# EAGLE schematic Full set (EAGLE 7.2.0)
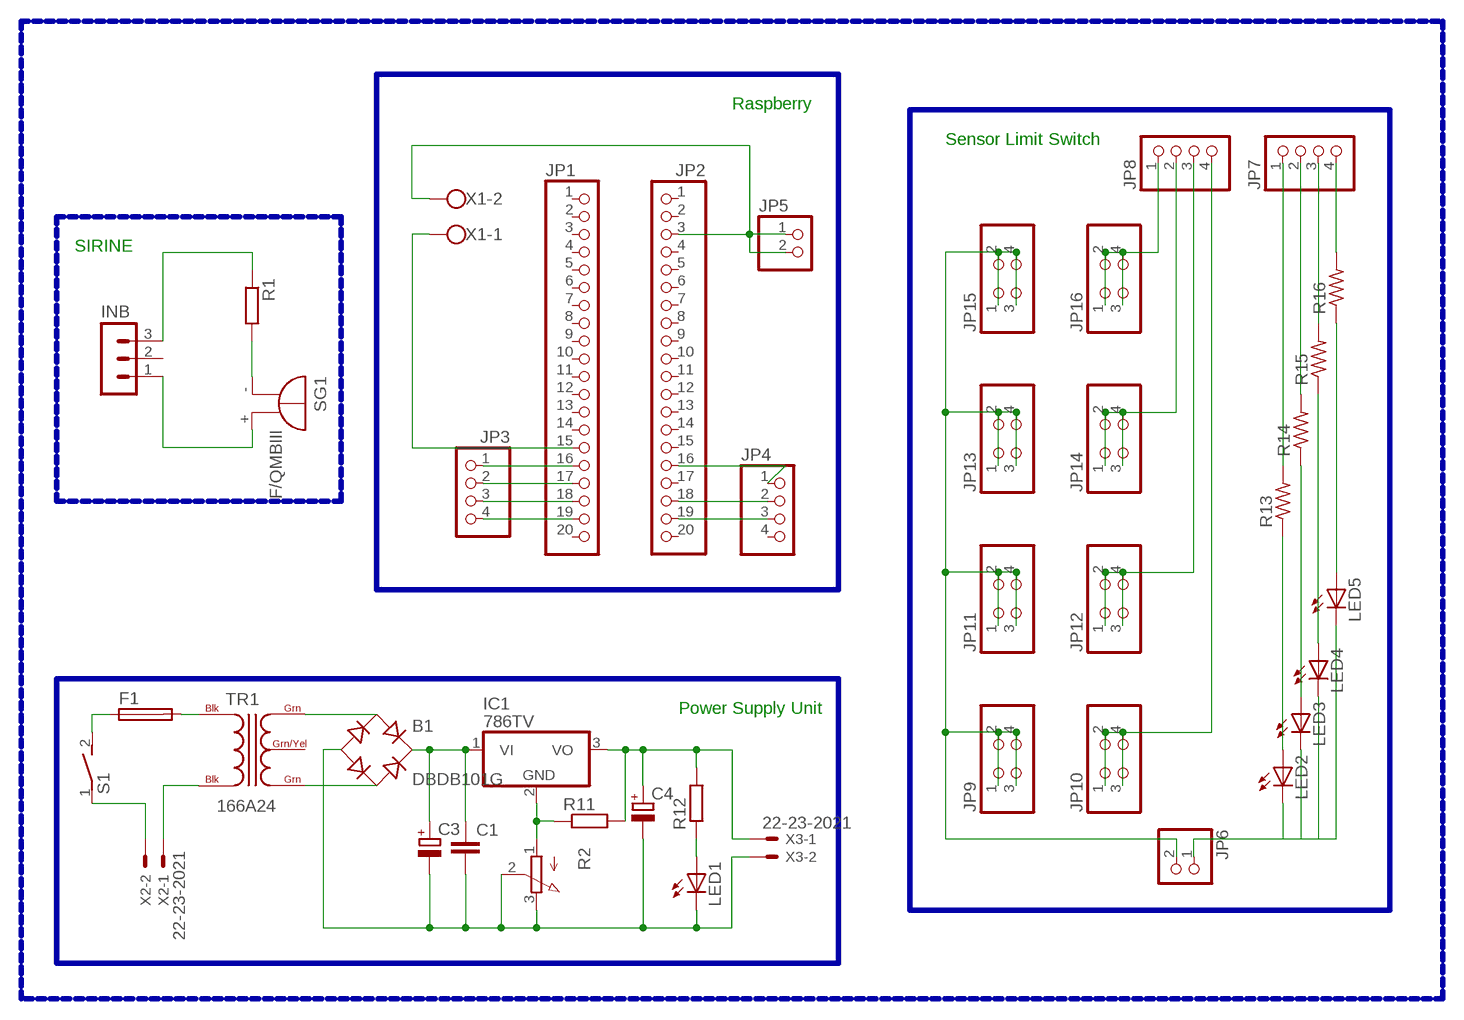
[diagram p0: schematic, sheet 1]

## Parts
B1  DBDB101G  [DB]
C1  C-EU075-032X103  [C075-032X103]
C3  CPOL-EUE5-8.5  [E5-8,5]
C4  CPOL-EUE5-6  [E5-6]
F1  19560  [19560]
IC1  786TV  [TO220V]
INB  MA03-1  [MA03-1]
JP1  PINHD-1X20  [1X20]
JP2  PINHD-1X20  [1X20]
JP3  PINHD-1X4  [1X04]
JP4  PINHD-1X4  [1X04]
JP5  PINHD-1X2  [1X02]
JP6  PINHD-1X2  [1X02]
JP7  PINHD-1X4  [1X04]
JP8  PINHD-1X4  [1X04]
JP9  PINHD-2X2  [2X02]
JP10  PINHD-2X2  [2X02]
JP11  PINHD-2X2  [2X02]
JP12  PINHD-2X2  [2X02]
JP13  PINHD-2X2  [2X02]
JP14  PINHD-2X2  [2X02]
JP15  PINHD-2X2  [2X02]
JP16  PINHD-2X2  [2X02]
LED1  LEDB152  [Q62902-B152]
LED2  LED3MM  [LED3MM]
LED3  LED3MM  [LED3MM]
LED4  LED3MM  [LED3MM]
LED5  LED3MM  [LED3MM]
R1  R-EU_0204/5  [0204/5]
R2  3RP/1610N  [3RP/1610N]
R11  R-EU_0309/12  [0309/12]
R12  R-EU_0309/12  [0309/12]
R13  R-US_0207/10  [0207/10]
R14  R-US_0207/10  [0207/10]
R15  R-US_0207/10  [0207/10]
R16  R-US_0207/10  [0207/10]
S1  DS01E  [DS-01]
SG1  F/QMBIII  [F/QMBIII]
TR1  166A24  [C2H]
X1  W237-102  [W237-102]
X2  22-23-2021  [22-23-2021]
X3  22-23-2021  [22-23-2021]

## Nets
N$1: LED1.A R12.1
N$2: F1.1 S1.2
N$3: F1.2 TR1.BLK@1(BLK)
N$4: JP2.3 JP5.1 JP5.2 X1.2
N$5: TR1.BLK@2(BLK) X2.1
N$6: S1.1 X2.2
N$7: B1.AC1 TR1.GRN@1(GRN)
N$8: B1.AC2 TR1.GRN@2(GRN)
N$9: B1.+ C1.1 C3.+ IC1.1(VI)
N$10: IC1.2(GND) R2.1(A) R11.1
N$11: C4.+ IC1.3(VO) R11.2 R12.2 X3.1
N$12: B1.- C1.2 C3.- C4.- LED1.K(C) R2.2(S) R2.3(E) X3.2
N$13: LED5.A R16.1
N$14: LED4.A R15.1
N$15: LED3.A R14.1
N$16: LED2.A R13.1
N$17: JP6.1 LED2.K(C) LED3.K(C) LED4.K(C) LED5.K(C)
N$18: JP7.4 R16.2
N$19: JP7.3 R15.2
N$20: JP7.2 R14.2
N$21: JP7.1 R13.2
N$22: JP8.4 JP10.1 JP10.2 JP10.3 JP10.4
N$24: JP8.3 JP12.1 JP12.2 JP12.3 JP12.4
N$26: JP8.2 JP14.1 JP14.2 JP14.3 JP14.4
N$28: INB.1 SG1.+(-)
N$29: INB.3 R1.1
N$30: R1.2 SG1.-(+)
N$31: JP8.1 JP16.1 JP16.2 JP16.3 JP16.4
N$32: JP2.19 JP4.3
N$33: JP2.18 JP4.2
N$34: JP2.16 JP4.1
N$35: JP1.19 JP3.4
N$45: JP1.18 JP3.3
N$46: JP1.17 JP3.2
N$47: JP1.16 JP3.1
N$48: JP1.15 X1.1
N$50: JP6.2 JP9.1 JP9.2 JP9.3 JP9.4 JP11.1 JP11.2 JP11.3 JP11.4 JP13.1 JP13.2 JP13.3 JP13.4 JP15.1 JP15.2 JP15.3 JP15.4
Unconnected: INB.2 JP1.1 JP1.2 JP1.3 JP1.4 JP1.5 JP1.6 JP1.7 JP1.8 JP1.9 JP1.10 JP1.11 JP1.12 JP1.13 JP1.14 JP1.20 JP2.1 JP2.2 JP2.4 JP2.5 JP2.6 JP2.7 JP2.8 JP2.9 JP2.10 JP2.11 JP2.12 JP2.13 JP2.14 JP2.15 JP2.17 JP2.20 JP4.4 TR1.GRN/YEL

## Buses
B$2
B$4
N$28,N$29,N$30
B$1
B$5

## Notes on the sheet
- Raspberry
- Sensor Limit Switch
- SIRINE
- Power Supply Unit

## Library data of the parts
B1 = rectifier:DB?*G: Single Phase 1.0 AMP Glass Passivated Bridge Rectifier Taiwan Semiconductor Co.,Ltd. - TSC Source: http://www.taiwansemi.com/TSCbig5/ezcatfiles/cust/img/img/db101g.pdf http://www.ts.com.tw/db/pictures/modules/PDT/PDT060207001/DBLS201G.pdf
C1 = rcl:C-EU: CAPACITOR, European symbol
C3 C4 = rcl:CPOL-EU: POLARIZED CAPACITOR, European symbol
F1 = fuse:19560: FUSE HOLDER TR5, Wickmann; MPN: 56000001009; OC_FARNELL: 1185363; OC_NEWARK: 15P8392
IC1 = linear:78*: Positive VOLTAGE REGULATOR Source: http://cache.national.com/ds/LM/LM78L05.pdf http://www.fairchildsemi.com/ds/LM/LM7805.pdf
INB = con-lstb:MA03-1: PIN HEADER; OC_FARNELL: unknown; OC_NEWARK: unknown
JP1 JP2 = pinhead:PINHD-1X20: PIN HEADER
JP3 JP4 JP7 JP8 = pinhead:PINHD-1X4: PIN HEADER
JP5 JP6 = pinhead:PINHD-1X2: PIN HEADER
JP9-JP16 = pinhead:PINHD-2X2: PIN HEADER
LED1-LED5 = led:LED: LED OSRAM: - CHIPLED LG R971, LG N971, LY N971, LG Q971, LY Q971, LO R971, LY R971 LH N974, LH R974 LS Q976, LO Q976, LY Q976 LO Q996 - Hyper CHIPLED LW Q18S LB Q993, LB Q99A, LB R99A - SideLED LS A670, LO A670, LY A670, LG A670, LP A670 LB A673, LV A673, LT A673, LW A673 LH A674 LY A675 LS A676, LA A676, LO A676, LY A676, LW A676 LS A679, LY A679, LG A679 - Hyper Micro SIDELED® LS Y876, LA Y876, LO Y876, LY Y876 LT Y87S - SmartLED LW L88C, LW L88S LB L89C, LB L89S, LG L890 LS L89K, LO L89K, LY L89K LS L896, LA L896, LO L896, LY L896 - TOPLED LS T670, LO T670, LY T670, LG T670, LP T670 LSG T670, LSP T670, LSY T670, LOP T670, LYG T670 LG T671, LOG T671, LSG T671 LB T673, LV T673, LT T673, LW T673 LH T674 LS T676, LA T676, LO T676, LY T676, LB T676, LH T676, LSB T676, LW T676 LB T67C, LV T67C, LT T67C, LS T67K, LO T67K, LY T67K, LW E67C LS E67B, LA E67B, LO E67B, LY E67B, LB E67C, LV E67C, LT E67C LW T67C LS T679, LY T679, LG T679 LS T770, LO T770, LY T770, LG T770, LP T770 LB T773, LV T773, LT T773, LW T773 LH T774 LS E675, LA E675, LY E675, LS T675 LS T776, LA T776, LO T776, LY T776, LB T776 LHGB T686 LT T68C, LB T68C - Hyper Mini TOPLED® LB M676 - Mini TOPLED Santana® LG M470 LS M47K, LO M47K, LY M47K Source: http://www.osram.convergy.de LUXEON: - LUMILED® LXK2-PW12-R00, LXK2-PW12-S00, LXK2-PW14-U00, LXK2-PW14-V00 LXK2-PM12-R00, LXK2-PM12-S00, LXK2-PM14-U00 LXK2-PE12-Q00, LXK2-PE12-R00, LXK2-PE12-S00, LXK2-PE14-T00, LXK2-PE14-U00 LXK2-PB12-K00, LXK2-PB12-L00, LXK2-PB12-M00, LXK2-PB14-N00, LXK2-PB14-P00, LXK2-PB14-Q00 LXK2-PR12-L00, LXK2-PR12-M00, LXK2-PR14-Q00, LXK2-PR14-R00 LXK2-PD12-Q00, LXK2-PD12-R00, LXK2-PD12-S00 LXK2-PH12-R00, LXK2-PH12-S00 LXK2-PL12-P00, LXK2-PL12-Q00, LXK2-PL12-R00 Source: www.luxeon.com KINGBRIGHT: KA-3528ASYC Source: www.kingbright.com
R1 = resistor:R-EU_: RESISTOR, European symbol
R2 = pot:3RP/1610N: 16mm Potentiometer one level Source: http://www.alphapotentiometers.net/html/16mm_pot_2.html
R11 R12 = rcl:R-EU_: RESISTOR, European symbol
R13-R16 = rcl:R-US_: RESISTOR, American symbol
S1 = switch-dil:DS01E: DIL/CODE SWITCH; OC_FARNELL: unknown; OC_NEWARK: unknown
SG1 = buzzer:F/QMBIII: BUZZER Source: Buerklin; OC_FARNELL: unknown; OC_NEWARK: unknown
TR1 = trafo-hammondmfg:166: OPEN STYLE FILAMENT & L.V. RECTIFIER USE TRANSFORMERS Economical single primnary 115VAC, 60 Hz or 117 VAC 50/60 Hz Source: Data sheet <http://www.hammondmfg.com/166.htm>
X1 = con-wago-500:W237-102: WAGO SCREW CLAMP; MPN: 237-102; OC_FARNELL: unknown; OC_NEWARK: 70K9898
X2 X3 = con-molex:22-23-2021: .100" (2.54mm) Center Header - 2 Pin; MF: MOLEX; MPN: 22-23-2021; OC_FARNELL: 1462926; OC_NEWARK: 25C3832